# Altium project ACDC.PrjPcb
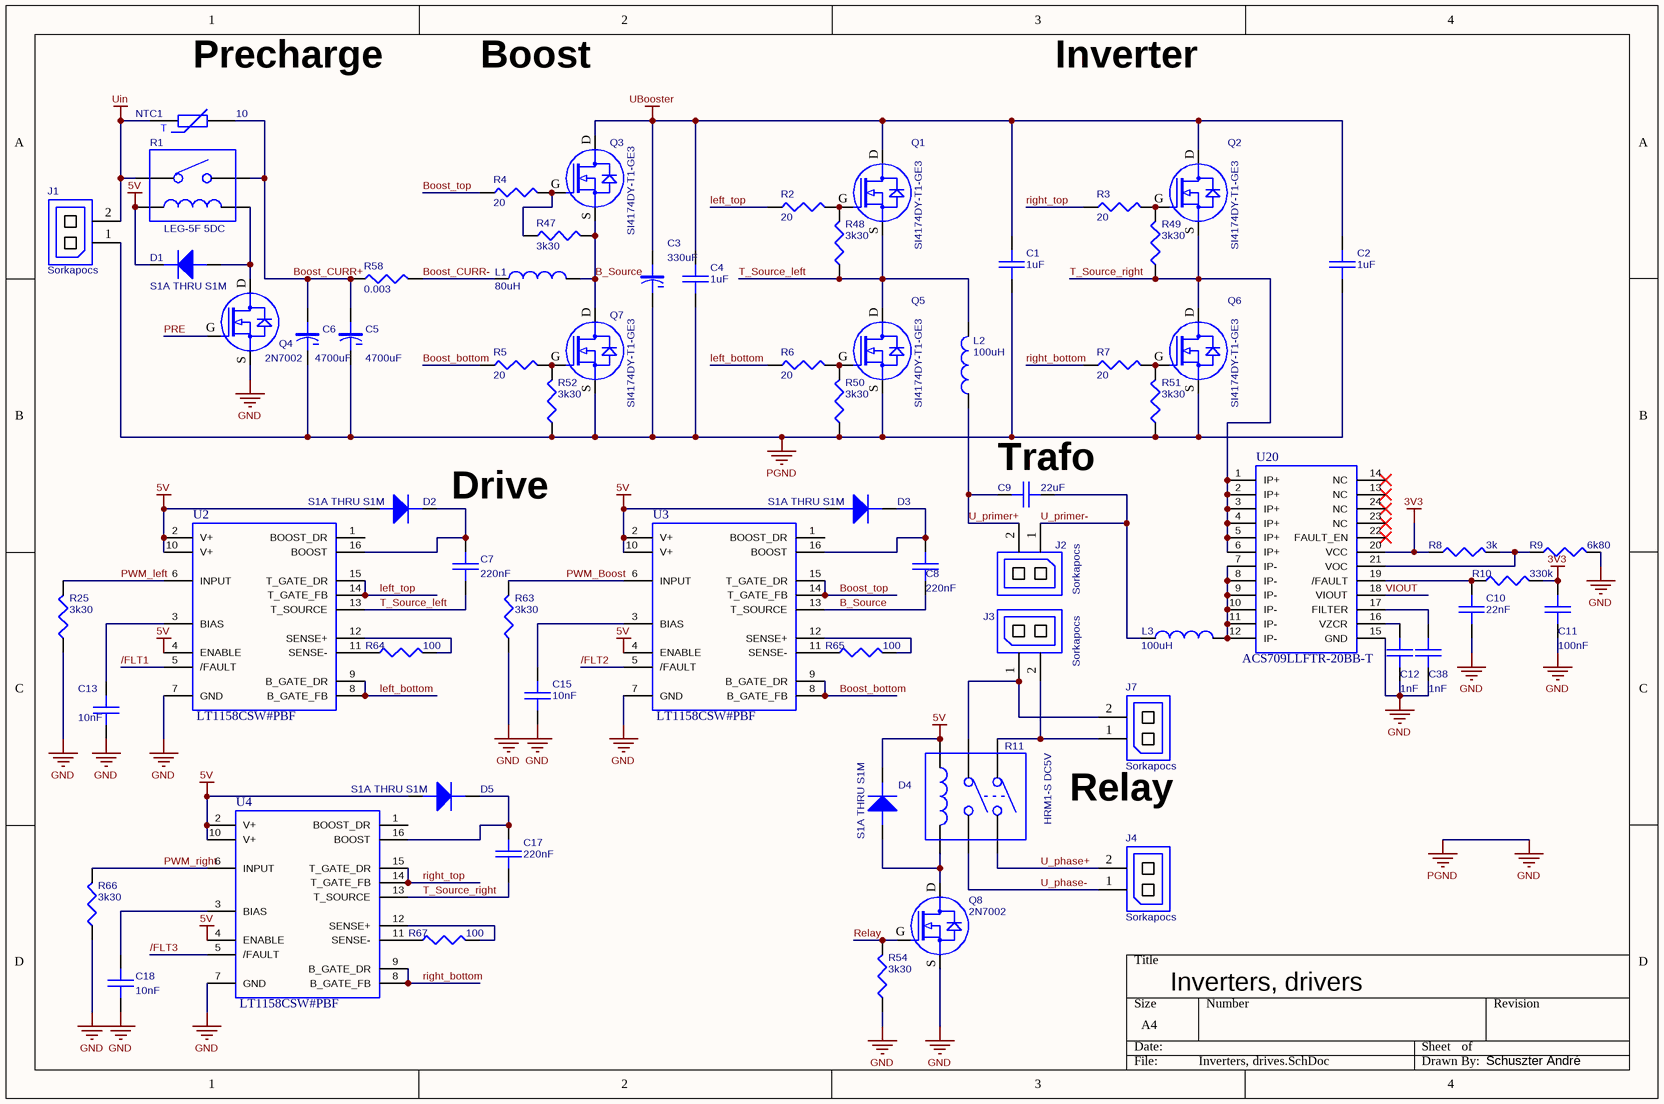
[diagram p0: Inverters, drives.SchDoc]
ModificationIndex: 0; PCBName: PCB177; PCBRevision: A; Project: Mini PCI Express Module; ProjectDate: 10-02-17; ProjectDrawnBy: Schuszter André; ProjectName: DCAC converter; ProjectOwner: Schuszter André; Title: Block Diagram
3 sheets, 164 parts. Net scope: global (net labels, ports and power ports of the same name join across sheets).
Board file: PCB_ACDC.PcbDoc
Sheets:
  Inverters, drives.SchDoc
  microcontroller.SchDoc
  Measurement.SchDoc

## Sheet Inverters, drives.SchDoc: Inverters, drivers
size A4; Author: Schuszter André; DrawnBy: Schuszter André; Revision: A

### Parts
C1  1uF  [CAPC3216X07N]
C2  1uF  [CAPC3216X07N]
C3  330uF  [CAPAE116103X105N]
C4  1uF  [CAPC3216X07N]
C5  4700uF  [CAPAE189170X165N]
C6  4700uF  [CAPAE189170X165N]
C7  220nF  [CAPC2012X06N]
C8  220nF  [CAPC2012X06N]
C9  22uF  [MKS4D052206F00KYSD]
C10  22nF  [CAPC2012X06N]
C11  100nF  [CAPC2012X06N]
C12  1nF  [CAPC2012X06N]
C13  10nF  [CAPC2012X06N]
C15  10nF  [CAPC2012X06N]
C17  220nF  [CAPC2012X06N]
C18  10nF  [CAPC2012X06N]
C38  1nF  [CAPC2012X06N]
D1  S1A THRU S1M  [DIOM4436X25N]
D2  S1A THRU S1M  [DIOM4436X25N]
D3  S1A THRU S1M  [DIOM4436X25N]
D4  S1A THRU S1M  [DIOM4436X25N]
D5  S1A THRU S1M  [DIOM4436X25N]
J1  Sorkapocs  [sorkapocs]
J2  Sorkapocs  [sorkapocs]
J3  Sorkapocs  [sorkapocs]
J4  Sorkapocs  [sorkapocs]
J7  Sorkapocs  [sorkapocs]
L1  80uH  [IND_160uH]
L2  100uH  [IND_160uH]
L3  100uH  [IND_160uH]
NTC1  10  [NTC]
Q1  SI4174DY-T1-GE3  [SOIC8-InvFet]
Q2  SI4174DY-T1-GE3  [SOIC8-InvFet]
Q3  SI4174DY-T1-GE3  [SOIC8-InvFet]
Q4  2N7002  [SOT95P240X111_SGD-3N]
Q5  SI4174DY-T1-GE3  [SOIC8-InvFet]
Q6  SI4174DY-T1-GE3  [SOIC8-InvFet]
Q7  SI4174DY-T1-GE3  [SOIC8-InvFet]
Q8  2N7002  [SOT95P240X111_SGD-3N]
R1  LEG-5F 5DC  [relay_1]
R2  20  [RESC2012X06N]
R3  20  [RESC2012X06N]
R4  20  [RESC2012X06N]
R5  20  [RESC2012X06N]
R6  20  [RESC2012X06N]
R7  20  [RESC2012X06N]
R8  3k  [RESC2012X06N]
R9  6k80  [RESC2012X06N]
R10  330k  [RESC2012X06N]
R11  HRM1-S DC5V  [relay]
R25  3k30  [RESC2012X06N]
R47  3k30  [RESC2012X06N]
R48  3k30  [RESC2012X06N]
R49  3k30  [RESC2012X06N]
R50  3k30  [RESC2012X06N]
R51  3k30  [RESC2012X06N]
R52  3k30  [RESC2012X06N]
R54  3k30  [RESC2012X06N]
R58  0.003  [RESC6432X07N]
R63  3k30  [RESC2012X06N]
R64  100  [RESC2012X06N]
R65  100  [RESC2012X06N]
R66  3k30  [RESC2012X06N]
R67  100  [RESC2012X06N]
U2  LT1158CSW#PBF  [SOIC127P1060X265-16N]
U3  LT1158CSW#PBF  [SOIC127P1060X265-16N]
U4  LT1158CSW#PBF  [SOIC127P1060X265-16N]
U20  ACS709LLFTR-20BB-T  [SOP64P600X175-24N]

### Nets
3V3: C11.1 R8.1 R10.2 U20.20(VCC)
5V: D1.C(CATHODE) D2.A(ANODE) D3.A(ANODE) D4.C(CATHODE) D5.A(ANODE) R1.1(VCC) R11.1(VCC) U2.2(V+) U2.4(ENABLE) U2.10(V+) U3.2(V+) U3.4(ENABLE) U3.10(V+) U4.2(V+) U4.4(ENABLE) U4.10(V+)
GND: C1.2 C2.2 C3.2(N) C4.2 C5.2(N) C6.2(N) C10.2 C11.2 C12.2 C13.2 C15.2 C18.2 C38.2 J1.1(P1) Q4.S Q5.S Q6.S Q7.S Q8.S R9.2 R25.1 R50.1 R51.1 R52.1 R54.1 R63.1 R66.1 U2.7(GND) U3.7(GND) U4.7(GND) U20.15(GND)  [also labelled PGND]
UBooster: C1.1 C2.1 C3.1(P) C4.1 Q1.D Q2.D Q3.D
Uin: J1.2(P2) NTC1.1 R1.3
/FLT1: U2.5(/FAULT)
/FLT2: U3.5(/FAULT)
/FLT3: U4.5(/FAULT)
B_Source: C8.2 L1.2 Q3.S Q7.D R47.2 U3.13(T_SOURCE)
Boost_bottom: R5.1 U3.8(B_GATE_FB) U3.9(B_GATE_DR)
Boost_CURR+: C5.1(P) C6.1(P) NTC1.2 R1.4 R58.1
Boost_CURR-: L1.1 R58.2
Boost_top: R4.1 U3.14(T_GATE_FB) U3.15(T_GATE_DR)
left_bottom: R6.1 U2.8(B_GATE_FB) U2.9(B_GATE_DR)
left_top: R2.1 U2.14(T_GATE_FB) U2.15(T_GATE_DR)
PRE: Q4.G
PWM_Boost: R63.2 U3.6(INPUT)
PWM_left: R25.2 U2.6(INPUT)
PWM_right: R66.2 U4.6(INPUT)
Relay: Q8.G R54.2
right_bottom: R7.1 U4.8(B_GATE_FB) U4.9(B_GATE_DR)
right_top: R3.1 U4.14(T_GATE_FB) U4.15(T_GATE_DR)
T_Source_left: C7.2 L2.2 Q1.S Q5.D R48.1 U2.13(T_SOURCE)
T_Source_right: C17.2 Q2.S Q6.D R49.1 U4.13(T_SOURCE) U20.1(IP+) U20.2(IP+) U20.3(IP+) U20.4(IP+) U20.5(IP+) U20.6(IP+)
U_phase+: J4.2(P2) R11.6
U_phase-: J4.1(P1) R11.4
U_primer+: C9.1 J2.2(P2) L2.1
U_primer-: C9.2 J2.1(P1) L3.1
VIOUT: U20.18(VIOUT)
NetC7_1: C7.1 D2.C(CATHODE) U2.16(BOOST)
NetC8_1: C8.1 D3.C(CATHODE) U3.16(BOOST)
NetC10_1: C10.1 R10.1 U20.19(/FAULT)
NetC12_1: C12.1 U20.16(VZCR)
NetC13_1: C13.1 U2.3(BIAS)
NetC15_1: C15.1 U3.3(BIAS)
NetC17_1: C17.1 D5.C(CATHODE) U4.16(BOOST)
NetC18_1: C18.1 U4.3(BIAS)
NetC38_1: C38.1 U20.17(FILTER)
NetD1_A: D1.A(ANODE) Q4.D R1.2(GND)
NetD4_A: D4.A(ANODE) Q8.D R11.2(GND)
NetJ3_1: J3.1(P1) J7.2(P2) R11.3
NetJ3_2: J3.2(P2) J7.1(P1) R11.5
NetL3_2: L3.2 U20.7(IP-) U20.8(IP-) U20.9(IP-) U20.10(IP-) U20.11(IP-) U20.12(IP-)
NetQ1_G: Q1.G R2.2 R48.2
NetQ2_G: Q2.G R3.2 R49.2
NetQ3_G: Q3.G R4.2 R47.1
NetQ5_G: Q5.G R6.2 R50.2
NetQ6_G: Q6.G R7.2 R51.2
NetQ7_G: Q7.G R5.2 R52.2
NetR8_2: R8.2 R9.1 U20.21(VOC)
NetR64_1: R64.1 U2.11(SENSE-)
NetR64_2: R64.2 U2.12(SENSE+)
NetR65_1: R65.1 U3.11(SENSE-)
NetR65_2: R65.2 U3.12(SENSE+)
NetR67_1: R67.1 U4.11(SENSE-)
NetR67_2: R67.2 U4.12(SENSE+)

Not connected (* = marked no-connect by the designer): U2 1(BOOST_DR); U3 1(BOOST_DR); U4 1(BOOST_DR); U20 13(NC)* 14(NC)* 22(FAULT_EN)* 23(NC)* 24(NC)*

### Notes on the sheet
- (near NTC1) Precharge
- Boost
- Inverter
- (near C9) Trafo
- Drive
- (near J7) Relay
- (in symbol NTC) T

### Library data of the parts
C1 C2 = Csnubber: 2495497; Part number: 0805F105Z500CT; Supplier: Farnell; Code: 2495497
C3 = CAPAE: 2611390; Part number: MCVVT035M331GB3L; Supplier: Farnell; Code: 2611390
C4 = Csnubber: 2495497; Part number: GRM31CR6YA106KA12L; Supplier: Farnell; Code: 2495497
C5 C6 = CAPAE: 2326365; Part number: EEVFK1C472M; Supplier: Farnell; Code: 2326365
C7 C8 C17 = CAPC: 82-03-85
C9 = CAPC: 07-06-83; Part number: 22uF 100V RM27.5 10% FOL MKS4 MKS4D052206F00KYSD (WIM) 15x26x31.5mm; Supplier: Lomex; Code: 07-06-83
C10 = CAPC: 82-00-77
C11 = CAPC: 82-07-32
C12 C38 = CAPC: 82-00-75
C13 C15 C18 = CAPC: 82-05-66
D1-D5 = RELÉ_DIO: 83-02-64; Part number: 1A 1000V DO-214AC RECT. S1M (YET) SMA; Supplier: Lomex; Code: 83-02-64
J1-J4 J7 = Sorkapocs: 43-07-92; Part number: SORKAPOCS 2 P RM5.08 CLL5.08/2 (STE) h=13.8mm LIFT.2.5mmř 24A; Supplier: Lomex; Code: 43-07-92
L1-L3 = IND
NTC1 = NTC: 1688795; Part number: B57153S0100M000; Supplier: Farnell; Code: 1688795
Q1-Q3 Q5-Q7 = INVERTER_NFET: 1840422; Part number: SI4174DY-T1-GE3; Supplier: Farnell; Code: 1840422
Q4 Q8 = RELÉ_NFET: 86-00-97; Part number: 2N7002 (NXP) N-FET 60V 0.3A 0.83W Rds>5R SOT-23 ˝12W˝ (SN7002); Supplier: Lomex; Code: 86-00-97
R1 = RELÉ_1CSAT: 42-02-61; Part number: LEG-5F 5DC (RAY) 70R; Supplier: Lomex; Code: 42-02-61
R2-R7 = RES_US_HOR: 81-11-96
R8 = RES_US_HOR: 81-16-68
R9 = RES_US_HOR: 81-10-97
R10 = RES_US_HOR: 80-15-29
R11 = RELÉ: 9479937; Supplier: Farnell; Code: 9479937; Part number: HRM1-S DC5V
R25 R47-R52 R54 R63 R66 = RES_US_HOR: 81-10-93
R58 = RES_US_HOR: 2356700; Part number: ERJ-M1WTF3M0U; Supplier: Farnell; Code: 2356700
R64 R65 R67 = RES_US_HOR: 81-10-75
U2-U4 = meghajtó: 1273473; Supplier: Farnell; Part number: LT1158CSW#PBF; Code: 1273473
U20 = árammérő: Code: 1858083; Supplier: Farnell; Part number: ACS709LLFTR-20BB-T

## Sheet microcontroller.SchDoc: Microcontroller
size A4; DrawnBy: Schuszter André
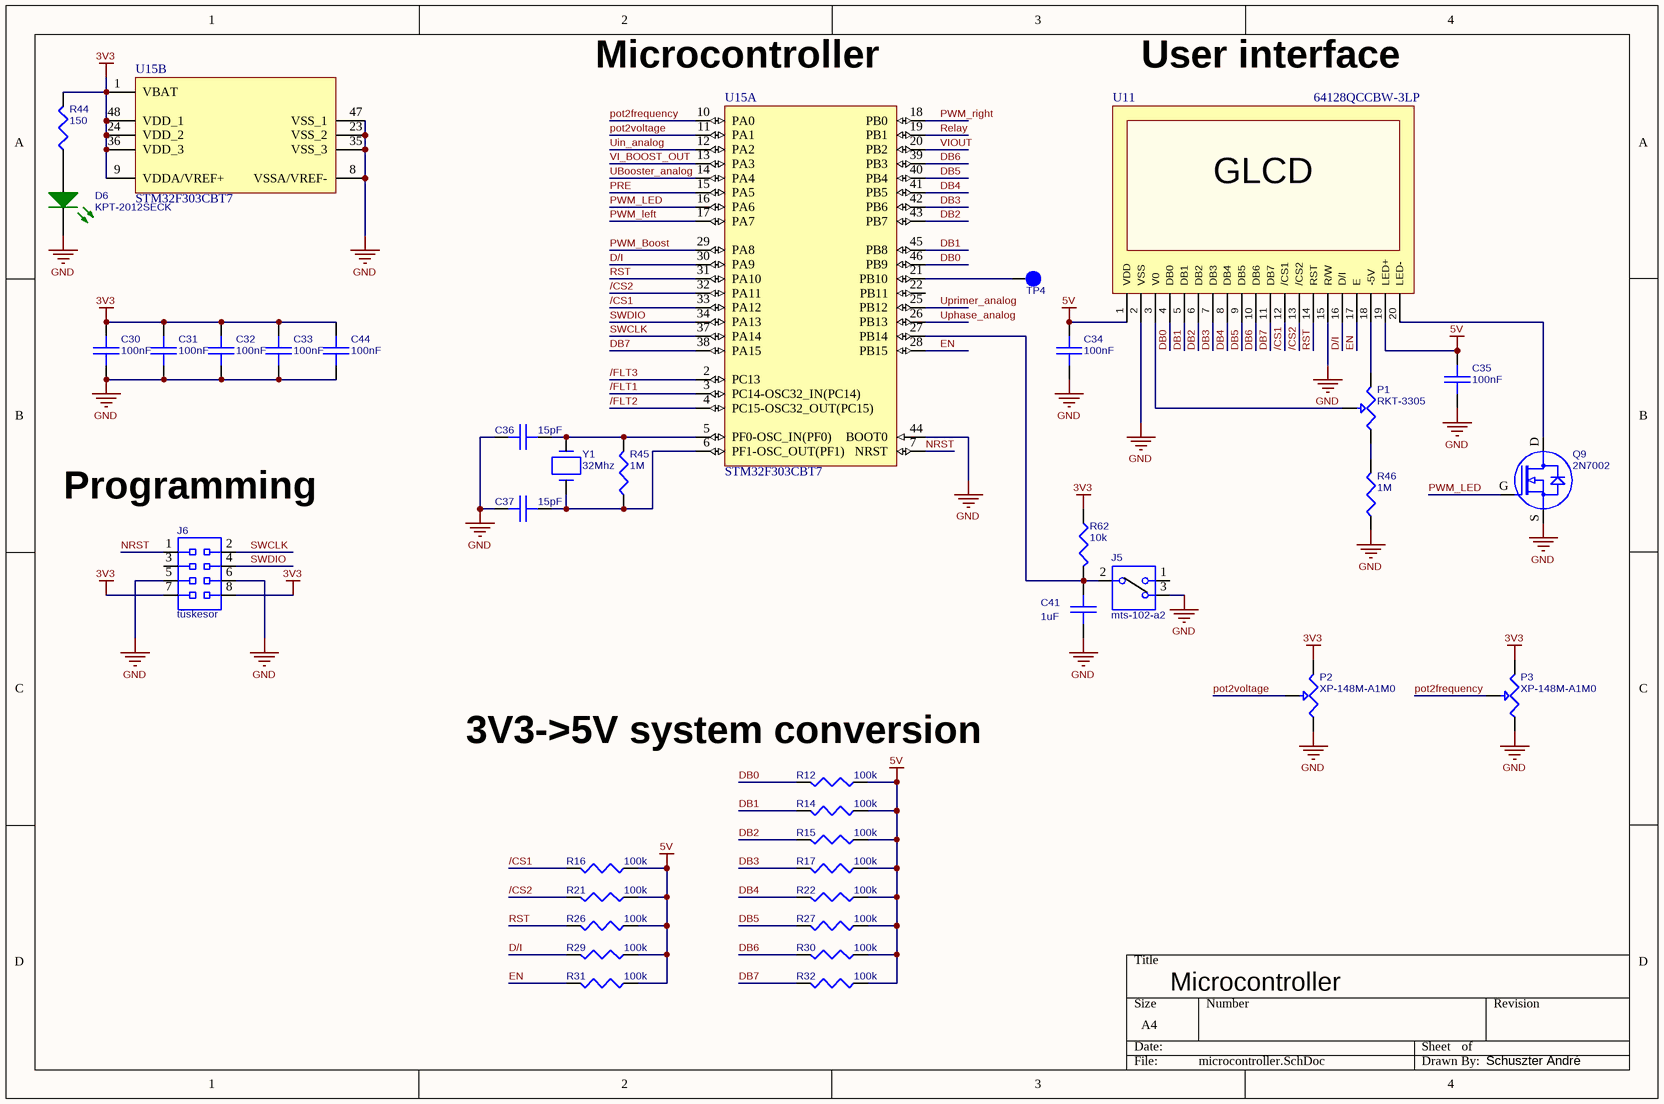
[diagram p1: microcontroller.SchDoc]

### Parts
C30  100nF  [CAPC2012X06N]
C31  100nF  [CAPC2012X06N]
C32  100nF  [CAPC2012X06N]
C33  100nF  [CAPC2012X06N]
C34  100nF  [CAPC2012X06N]
C35  100nF  [CAPC2012X06N]
C36  15pF  [CAPC2012X06N]
C37  15pF  [CAPC2012X06N]
C41  1uF  [CAPC2012X06N]
C44  100nF  [CAPC2012X06N]
D6  KPT-2012SECK  [LED2012X11N_GREEN]
J5  mts-102-a2  [TOGGLE]
J6  tüskesor  [PINH_M_2X4_100MIL_TH_HARWIN]
P1  RKT-3305  [TRIMMER]
P2  XP-148M-A1M0  [potmeter]
P3  XP-148M-A1M0  [potmeter]
Q9  2N7002  [SOT95P240X111_SGD-3N]
R12  100k  [RESC2012X06N]
R14  100k  [RESC2012X06N]
R15  100k  [RESC2012X06N]
R16  100k  [RESC2012X06N]
R17  100k  [RESC2012X06N]
R21  100k  [RESC2012X06N]
R22  100k  [RESC2012X06N]
R26  100k  [RESC2012X06N]
R27  100k  [RESC2012X06N]
R29  100k  [RESC2012X06N]
R30  100k  [RESC2012X06N]
R31  100k  [RESC2012X06N]
R32  100k  [RESC2012X06N]
R44  150  [RESC2012X06N]
R45  1M  [RESC2012X06N]
R46  1M  [RESC2012X06N]
R62  10k  [RESC2012X06N]
TP4  Comment  [TP200X150]  (value not drawn)  (no BOM)
U11  64128QCCBW-3LP  [LCD]
U15  STM32F303CBT7  [STM-LQFP48_N]  (parts A,B of 2)
Y1  32Mhz  [XTAL]

### Nets
3V3: C30.1 C31.1 C32.1 C33.1 C44.1 J6.7 J6.8 P2.3 P3.3 R44.2 R62.2 U15.1(VBAT) U15.9(VDDA/VREF+) U15.24(VDD_2) U15.36(VDD_3) U15.48(VDD_1)
5V: C34.1 C35.1 R12.1 R14.1 R15.1 R16.1 R17.1 R21.1 R22.1 R26.1 R27.1 R29.1 R30.1 R31.1 R32.1 U11.1(VDD) U11.19(LED+)
GND: C30.2 C31.2 C32.2 C33.2 C34.2 C35.2 C36.1 C37.1 C41.2 C44.2 D6.C J5.3 J6.5 J6.6 P2.1 P3.1 Q9.S R46.1 U11.2(VSS) U11.15(R/W) U15.8(VSSA/VREF-) U15.23(VSS_2) U15.35(VSS_3) U15.44(BOOT0) U15.47(VSS_1)
/CS1: R16.2 U11.12(/CS1) U15.33(PA12)
/CS2: R21.2 U11.13(/CS2) U15.32(PA11)
/FLT1: U15.3(PC14-OSC32_IN(PC14))
/FLT2: U15.4(PC15-OSC32_OUT(PC15))
/FLT3: U15.2(PC13)
D/I: R29.2 U11.16(D/I) U15.30(PA9)
DB0: R12.2 U11.4(DB0) U15.46(PB9)
DB1: R14.2 U11.5(DB1) U15.45(PB8)
DB2: R15.2 U11.6(DB2) U15.43(PB7)
DB3: R17.2 U11.7(DB3) U15.42(PB6)
DB4: R22.2 U11.8(DB4) U15.41(PB5)
DB5: R27.2 U11.9(DB5) U15.40(PB4)
DB6: R30.2 U11.10(DB6) U15.39(PB3)
DB7: R32.2 U11.11(DB7) U15.38(PA15)
EN: R31.2 U11.17(E) U15.28(PB15)
NRST: J6.1 U15.7(NRST)
pot2frequency: P3.2 U15.10(PA0)
pot2voltage: P2.2 U15.11(PA1)
PRE: U15.15(PA5)
PWM_Boost: U15.29(PA8)
PWM_LED: Q9.G U15.16(PA6)
PWM_left: U15.17(PA7)
PWM_right: U15.18(PB0)
Relay: U15.19(PB1)
RST: R26.2 U11.14(RST) U15.31(PA10)
SWCLK: J6.2 U15.37(PA14)
SWDIO: J6.4 U15.34(PA13)
UBooster_analog: U15.14(PA4)
Uin_analog: U15.12(PA2)
Uphase_analog: U15.26(PB13)
Uprimer_analog: U15.25(PB12)
VI_BOOST_OUT: U15.13(PA3)
VIOUT: U15.20(PB2)
NetC36_2: C36.2 R45.2 U15.5(PF0-OSC_IN(PF0)) Y1.2
NetC37_2: C37.2 R45.1 U15.6(PF1-OSC_OUT(PF1)) Y1.1
NetC41_1: C41.1 J5.2 R62.1 U15.27(PB14)
NetD6_A: D6.A R44.1
NetP1_1: P1.1 R46.2
NetP1_2: P1.2 U11.3(V0)
NetP1_3: P1.3 U11.18(-5V)
NetQ9_D: Q9.D U11.20(LED-)
NetTP4_1: TP4.1(Pin1) U15.21(PB10)

Not connected (* = marked no-connect by the designer): J5 1; J6 3; U15 22(PB11)

### Notes on the sheet
- (near U15) Microcontroller
- User interface
- (near J6) Programming
- (near R12) 3V3->5V system conversion
- (in symbol LCD) GLCD

### Library data of the parts
C30-C35 C44 = CAPC: 82-07-32
C36 C37 = CAPC: 82-00-94
C41 = CAPC: 2495497
D6 = LED_GREEN: 2099237; Code: 2099237; Part number: KPT-2012SECK; Supplier: Farnell
J5 = TOGGLE_SPDT: 45-08-76; Part number: TOGGLE D= 6 3P SPDT MTS-102-A2 (FEM) ON-ON 6A 125VAC 1AK.2ALL.PCB; Supplier: Lomex; Code: 45-08-76
J6 = CON_2X4
P1 = TRIMMER: 90-00-58; Supplier: Lomex; Code: 90-00-58; Part number: RKT-3305
P2 P3 = Potmeter: 06-03-80; Supplier: Lomex; Code: 06-03-80; Part number: XP-148M-A1M0
Q9 = RELÉ_NFET: as Q4 on sheet Inverters, drives; Supplier: Lomex; Code: 86-00-97
R12 R14-R17 R21 R22 R26 R27 R29-R32 = RES_US_HOR: 81-11-11
R44 = RES_US_HOR: 81-10-77
R45 R46 = RES_US_HOR: 81-11-22
R62 = RES_US_HOR: 80-10-98
TP4 = TP_SMD
U11 = LCD: Supplier: Lomex; Code: 37-00-71; Part number: 64128QCCBW-3LP
U15 = STM32F303CBT7: ARM Cortex-M4 32-bit MCU, 128 KB Flash, 32 KB Internal RAM, 37 I/Os, 48-pin LQFP, -40 to 105 degC, Tray; D/A Converter: 2x12-bit (2 Channel); FLASH Size (Prog) (kB): 128; I/Os (High Current): 37; Internal RAM Size (kB): 32; Operating Frequency(F) (Processor speed) (MHz): 72; Supply Voltage(Vcc) min (V): 2; DatasheetVersion: Rev. 6; PackageVersion: Rev. 6, 06/2013; PackageReference: LQFP48; PackageDescription: 48-Pin Low Profile Quad Flat Package, 7 x 7 mm Body, 0.5 mm Pitch; Supplier 1: Farnell; Supplier Part Number 1: 2333361; Supplier 2: Newark; Supplier Part Number 2: 99W9872; Supplier 3: Mouser; Supplier Part Number 3: N/A; Core: ARM Cortex-M4; Packing: Tray; Mounting Technology: Surface Mount; PartNumber: STM32F303CBT7; ComponentLink1Description: Manufacturer URL; ComponentLink1URL: http://www.st.com/web/en/home.html; ComponentLink2Description: Datasheet; ComponentLink2URL: http://www.st.com/st-web-ui/static/active/en/resource/technical/document/datasheet/DM00058181.pdf; ComponentLink3Description: Package Specification; ComponentLink3URL: http://www.st.com/st-web-ui/static/active/en/resource/technical/document/datasheet/DM00058181.pdf
Y1 = XTAL: 40-01-35; Part number: QUARZ HC49/S (NSK) 30ppm 20pF LOW PROFILE; Supplier: Lomex; code: 40-01-35

## Sheet Measurement.SchDoc: Measurements
size A4; DrawnBy: Schuszter André
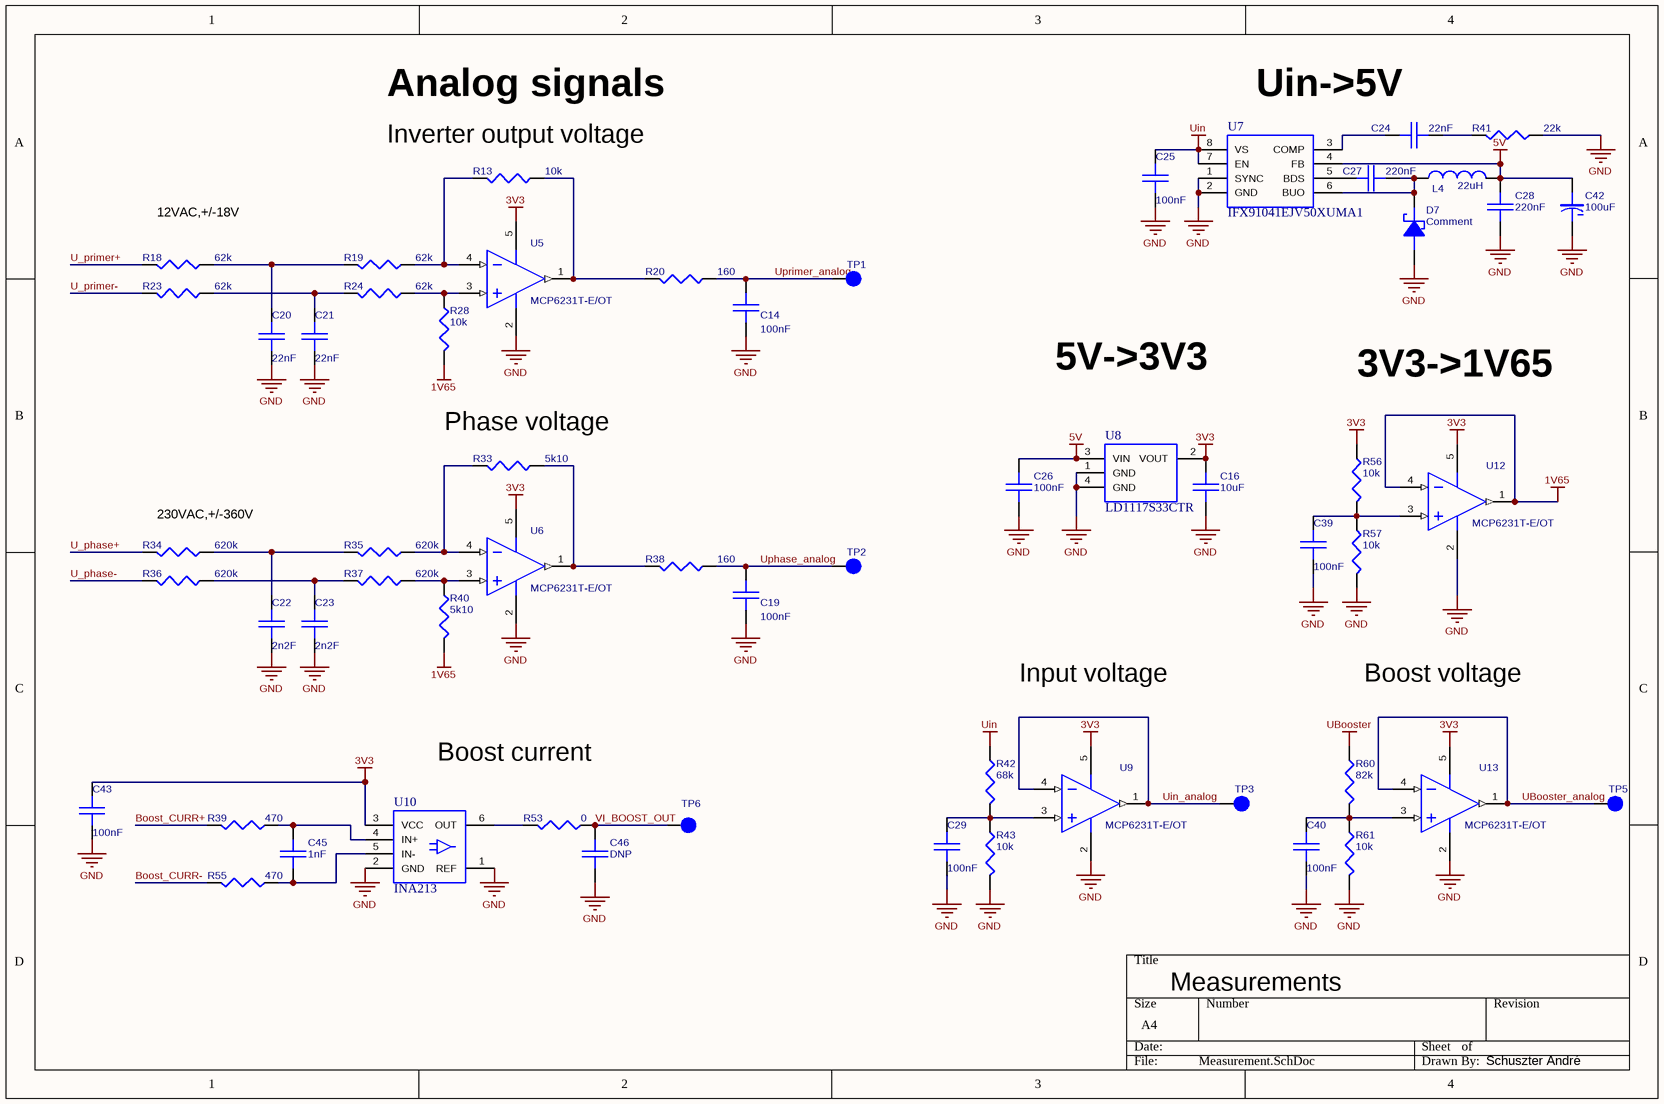
[diagram p2: Measurement.SchDoc]

### Parts
C14  100nF  [CAPC2012X06N]
C16  10uF  [CAPC2012X06N]
C19  100nF  [CAPC2012X06N]
C20  22nF  [CAPC2012X06N]
C21  22nF  [CAPC2012X06N]
C22  2n2F  [CAPC2012X06N]
C23  2n2F  [CAPC2012X06N]
C24  22nF  [CAPC2012X06N]
C25  100nF  [CAPC2012X06N]
C26  100nF  [CAPC2012X06N]
C27  220nF  [CAPC2012X06N]
C28  220nF  [CAPC2012X06N]
C29  100nF  [CAPC2012X06N]
C39  100nF  [CAPC2012X06N]
C40  100nF  [CAPC2012X06N]
C42  100uF  [CAPAE6253X61N_Buck]
C43  100nF  [CAPC2012X06N]
C45  1nF  [CAPC2012X06N]
C46  DNP  [CAPC2012X06N]
D7  Comment  [Schottky]
L4  22uH  [INDP6060X45N]
R13  10k  [RESC2012X06N]
R18  62k  [RESC2012X06N]
R19  62k  [RESC2012X06N]
R20  160  [RESC2012X06N]
R23  62k  [RESC2012X06N]
R24  62k  [RESC2012X06N]
R28  10k  [RESC2012X06N]
R33  5k10  [RESC2012X06N]
R34  620k  [RESC2012X06N]
R35  620k  [RESC2012X06N]
R36  620k  [RESC2012X06N]
R37  620k  [RESC2012X06N]
R38  160  [RESC2012X06N]
R39  470  [RESC2012X06N]
R40  5k10  [RESC2012X06N]
R41  22k  [RESC2012X06N]
R42  68k  [RESC2012X06N]
R43  10k  [RESC2012X06N]
R53  0  [RESC2012X06N]
R55  470  [RESC2012X06N]
R56  10k  [RESC2012X06N]
R57  10k  [RESC2012X06N]
R60  82k  [RESC2012X06N]
R61  10k  [RESC2012X06N]
TP1  Comment  [TP080]  (value not drawn)  (no BOM)
TP2  Comment  [TP080]  (value not drawn)  (no BOM)
TP3  Comment  [TP080]  (value not drawn)  (no BOM)
TP5  Comment  [TP080]  (value not drawn)  (no BOM)
TP6  Comment  [TP080]  (value not drawn)  (no BOM)
U5  MCP6231T-E/OT  [SOT23-5]
U6  MCP6231T-E/OT  [SOT23-5]
U7  IFX91041EJV50XUMA1  [BUCK_CONVERTER]
U8  LD1117S33CTR  [SOT230P700X180-4N]
U9  MCP6231T-E/OT  [SOT23-5]
U10  INA213  [SOT65P210X110-6N]
U12  MCP6231T-E/OT  [SOT23-5]
U13  MCP6231T-E/OT  [SOT23-5]

### Nets
1V65: R28.2 R40.2 U12.1(OUT) U12.4(IN-)
3V3: C16.2 C43.1 R56.1 U5.5(VDD) U6.5(VDD) U8.2(VOUT) U9.5(VDD) U10.3(VCC) U12.5(VDD) U13.5(VDD)
5V: C26.2 C28.2 C42.1(P) L4.2 U7.4(FB) U8.3(VIN)
GND: C14.2 C16.1 C19.2 C20.2 C21.2 C22.2 C23.2 C25.2 C26.1 C28.1 C29.2 C39.2 C40.2 C42.2(N) C43.2 C46.1 D7.A R41.1 R43.2 R57.2 R61.2 U5.2(GND) U6.2(GND) U7.1(SYNC) U7.2(GND) U8.1(GND) U8.4(GND) U9.2(GND) U10.1(REF) U10.2(GND) U12.2(GND) U13.2(GND)
UBooster: R60.1
Uin: C25.1 R42.1 U7.7(EN) U7.8(VS)
Boost_CURR+: R39.2
Boost_CURR-: R55.2
U_phase+: R34.2
U_phase-: R36.2
U_primer+: R18.2
U_primer-: R23.2
UBooster_analog: TP5.1(Pin1) U13.1(OUT) U13.4(IN-)
Uin_analog: TP3.1(Pin1) U9.1(OUT) U9.4(IN-)
Uphase_analog: C19.1 R38.1 TP2.1(Pin1)
Uprimer_analog: C14.1 R20.1 TP1.1(Pin1)
VI_BOOST_OUT: C46.2 R53.1 TP6.1(Pin1)
NetC20_1: C20.1 R18.1 R19.2
NetC21_1: C21.1 R23.1 R24.2
NetC22_1: C22.1 R34.1 R35.2
NetC23_1: C23.1 R36.1 R37.2
NetC24_1: C24.1 U7.3(COMP)
NetC24_2: C24.2 R41.2
NetC27_1: C27.1 U7.5(BDS)
NetC27_2: C27.2 D7.C L4.1 U7.6(BUO)
NetC29_1: C29.1 R42.2 R43.1 U9.3(IN+)
NetC39_1: C39.1 R56.2 R57.1 U12.3(IN+)
NetC40_1: C40.1 R60.2 R61.1 U13.3(IN+)
NetC45_1: C45.1 R55.1 U10.5(IN-)
NetC45_2: C45.2 R39.1 U10.4(IN+)
NetR13_1: R13.1 R20.2 U5.1(OUT)
NetR13_2: R13.2 R19.1 U5.4(IN-)
NetR24_1: R24.1 R28.1 U5.3(IN+)
NetR33_1: R33.1 R38.2 U6.1(OUT)
NetR33_2: R33.2 R35.1 U6.4(IN-)
NetR37_1: R37.1 R40.1 U6.3(IN+)
NetR53_2: R53.2 U10.6(OUT)

### Notes on the sheet
- Analog signals
- Uin->5V
- (near R13) Inverter output voltage
- (near R18) 12VAC,+/-18V
- 5V->3V3
- 3V3->1V65
- (near R33) Phase voltage
- (near R34) 230VAC,+/-360V
- Input voltage
- Boost voltage
- Boost current

### Library data of the parts
C14 C19 C25 C26 C29 C39 C40 C43 = CAPC: 82-07-32
C16 = CAPC: 82-10-67
C20 C21 C24 = CAPC: 82-00-77
C22 C23 = CAPC: 82-07-24
C27 C28 = CAPC: 82-03-85
C42 = CAPAE: 2068653; Part number: EDK107M016A9GAA; Supplier: Farnell; Code: 2068653
C45 = CAPC: 82-00-75
C46 = CAPC
D7 = DIO_SCHTTKY: 83-02-47; Part number: 1A 40V DO-214AC SCH.RECT. SS14; Code: 83-02-47; Supplier: Lomex
L4 = IND: 2066673; Part number: LQH6PPN470M43L; Code: 74404064220; Supplier: Farnell
R13 R28 R43 R56 R57 R61 = RES_US_HOR: 80-10-98
R18 R19 R23 R24 = RES_US_HOR: 80-11-30
R20 R38 = RES_US_HOR: 81-02-25
R33 R40 = RES_US_HOR: 80-14-91
R34-R37 = RES_US_HOR: 80-15-81
R39 R55 = RES_US_HOR: 81-10-83
R41 = RES_US_HOR: 81-11-03
R42 = RES_US_HOR: 80-11-08
R53 = RES_US_HOR: 81-10-02
R60 = RES_US_HOR: 80-11-09
TP1-TP3 TP5 TP6 = TP_SMD
U5 U6 U9 U12 U13 = követőerősítő: 1840879; Supplier: Lomex; Part number: MCP6231T-E/OT; Code: 1840879
U7 = 5V_BUCK: 2432504; Supplier: Farnell; Code: 2432504; Part number: IFX91041EJV50XUMA1
U8 = LDO5V-3V3: 1467779; Supplier: Farnell; Part number: LD1117S33CTR; Code: 1467779
U10 = INA213: 1754261; Part number: INA213AIDCKT; Code: 1754261; Supplier: Farnell

## Nets that join several sheets
3V3: Inverters, drives (C11.1 R8.1 R10.2 U20.20), microcontroller (16 pins), Measurement (10 pins)
5V: Inverters, drives (16 pins), microcontroller (17 pins), Measurement (6 pins)
GND: Inverters, drives (31 pins), microcontroller (25 pins), Measurement (32 pins)
UBooster: Inverters, drives (7 pins), Measurement (R60.1)
Uin: Inverters, drives (J1.2 NTC1.1 R1.3), Measurement (C25.1 R42.1 U7.7 U7.8)
/FLT1: Inverters, drives (U2.5), microcontroller (U15.3)
/FLT2: Inverters, drives (U3.5), microcontroller (U15.4)
/FLT3: Inverters, drives (U4.5), microcontroller (U15.2)
Boost_CURR+: Inverters, drives (5 pins), Measurement (R39.2)
Boost_CURR-: Inverters, drives (L1.1 R58.2), Measurement (R55.2)
PRE: Inverters, drives (Q4.G), microcontroller (U15.15)
PWM_Boost: Inverters, drives (R63.2 U3.6), microcontroller (U15.29)
PWM_left: Inverters, drives (R25.2 U2.6), microcontroller (U15.17)
PWM_right: Inverters, drives (R66.2 U4.6), microcontroller (U15.18)
Relay: Inverters, drives (Q8.G R54.2), microcontroller (U15.19)
U_phase+: Inverters, drives (J4.2 R11.6), Measurement (R34.2)
U_phase-: Inverters, drives (J4.1 R11.4), Measurement (R36.2)
U_primer+: Inverters, drives (C9.1 J2.2 L2.1), Measurement (R18.2)
U_primer-: Inverters, drives (C9.2 J2.1 L3.1), Measurement (R23.2)
UBooster_analog: microcontroller (U15.14), Measurement (TP5.1 U13.1 U13.4)
Uin_analog: microcontroller (U15.12), Measurement (TP3.1 U9.1 U9.4)
Uphase_analog: microcontroller (U15.26), Measurement (C19.1 R38.1 TP2.1)
Uprimer_analog: microcontroller (U15.25), Measurement (C14.1 R20.1 TP1.1)
VI_BOOST_OUT: microcontroller (U15.13), Measurement (C46.2 R53.1 TP6.1)
VIOUT: Inverters, drives (U20.18), microcontroller (U15.20)

## Assembly variants
Base: all parts fitted